# Altium schematic sheet Driver.SchDoc
size A4
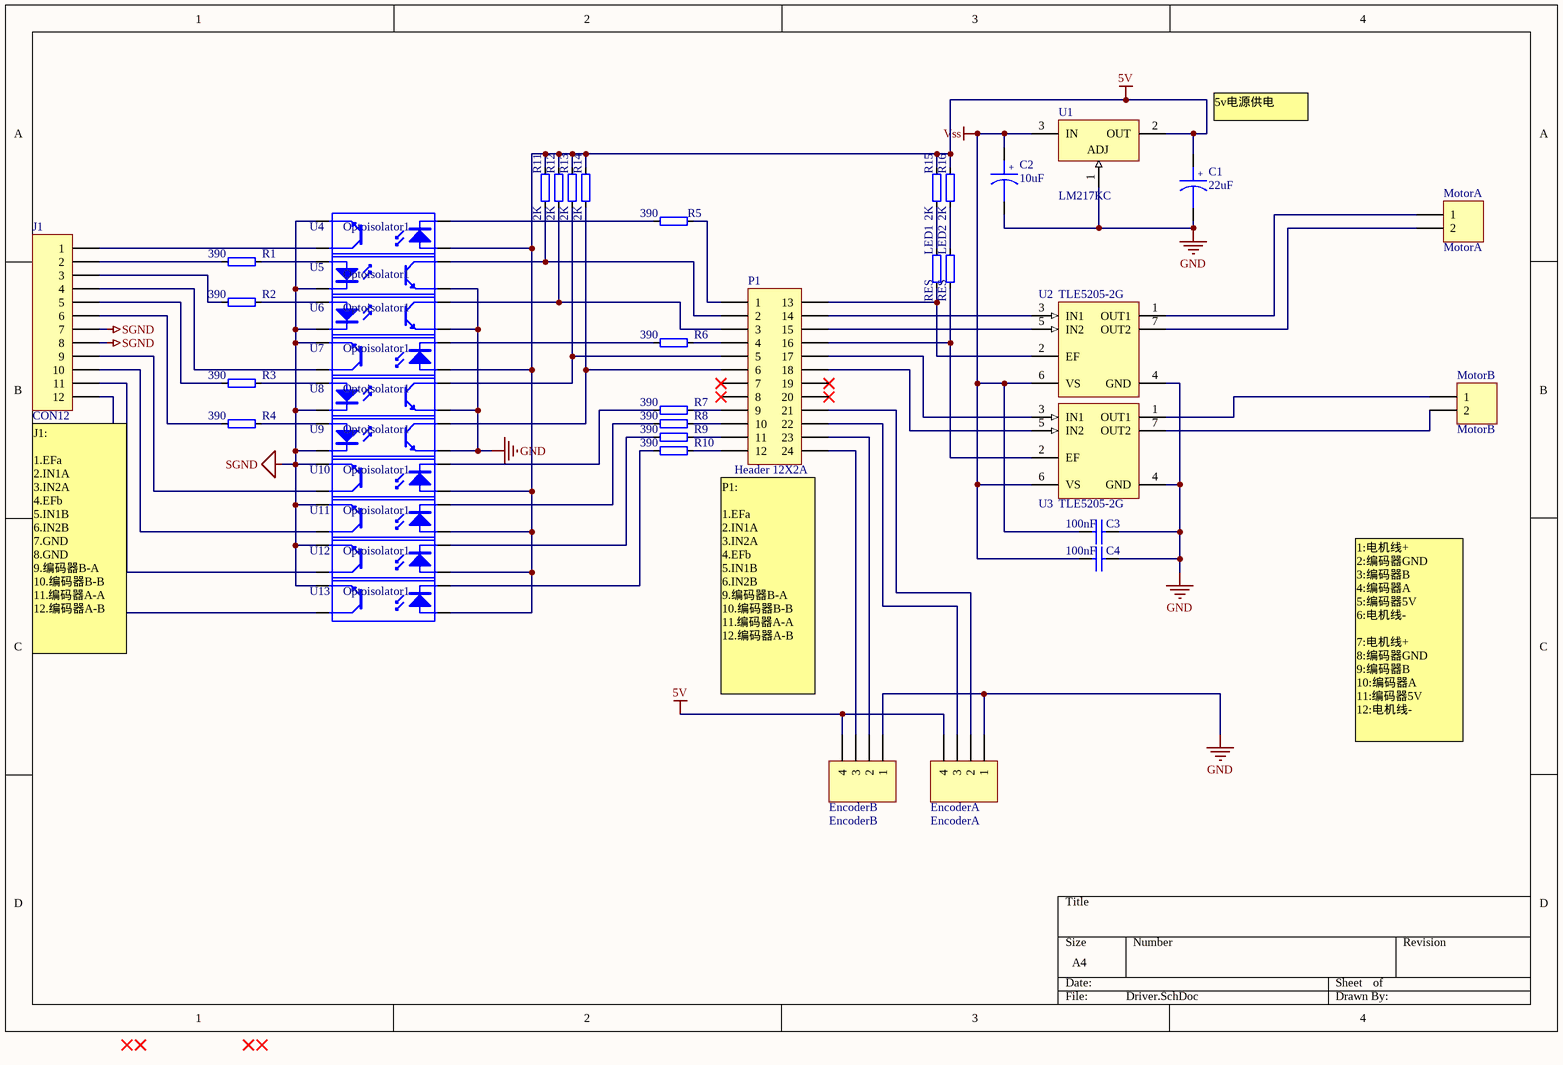
[diagram p0: Driver.SchDoc]

## Parts
C1  22uF  [RB.2/.4]
C2  10uF  [RB.2/.4]
C3  100nF  [0805]
C4  100nF  [0805]
EncoderA  EncoderA  [SIP4-150]
EncoderB  EncoderB  [SIP4-150]
J1  CON12  [si12]
LED1  RES  [LED-0805]
LED2  RES  [LED-0805]
MotorA  MotorA  [SIP2-150]
MotorB  MotorB  [SIP2-150]
P1  Header 12X2A  [si2333]
R1  390  [0603i]
R2  390  [0603i]
R3  390  [0603i]
R4  390  [0603i]
R5  390  [0603i]
R6  390  [0603i]
R7  390  [0603i]
R8  390  [0603i]
R9  390  [0603i]
R10  390  [0603i]
R11  2K  [0603i]
R12  2K  [0603i]
R13  2K  [0603i]
R14  2K  [0603i]
R15  2K  [0603i]
R16  2K  [0603i]
U1  LM217KC  [SOT223]
U2  TLE5205-2G  [INF-PG-TO263-7-1_L]
U3  TLE5205-2G  [INF-PG-TO263-7-1_L]
U4  Optoisolator1  [TLP281]
U5  Optoisolator1  [TLP281]
U6  Optoisolator1  [TLP281]
U7  Optoisolator1  [TLP281]
U8  Optoisolator1  [TLP281]
U9  Optoisolator1  [TLP281]
U10  Optoisolator1  [TLP281]
U11  Optoisolator1  [TLP281]
U12  Optoisolator1  [TLP281]
U13  Optoisolator1  [TLP281]

## Nets
5V: C1.1 EncoderA.4 EncoderB.4 R11.1 R12.1 R13.1 R14.1 R15.1 R16.1 U1.2(OUT) U4.1(A) U7.1(A) U10.1(A) U11.1(A) U12.1(A) U13.1(A)
GND: C1.2 C2.2 C3.2 C4.2 EncoderA.1 EncoderB.1 U1.1(ADJ) U2.4(GND) U3.4(GND) U5.3(E) U6.3(E) U8.3(E) U9.3(E)
SGND: J1.7 J1.8 U4.3(E) U5.2(K) U6.2(K) U7.3(E) U8.2(K) U9.2(K) U10.3(E) U11.3(E) U12.3(E) U13.3(E)
Vss: C2.1 C3.1 C4.1 U1.3(IN) U2.6(VS) U3.6(VS)
NetEncoderA_2: EncoderA.2 P1.21
NetEncoderA_3: EncoderA.3 P1.22
NetEncoderB_2: EncoderB.2 P1.23
NetEncoderB_3: EncoderB.3 P1.24
NetJ1_1: J1.1 U4.4(C)
NetJ1_2: J1.2 R1.2
NetJ1_3: J1.3 R2.2
NetJ1_4: J1.4 U7.4(C)
NetJ1_5: J1.5 R3.2
NetJ1_6: J1.6 R4.2
NetJ1_9: J1.9 U10.4(C)
NetJ1_10: J1.10 U11.4(C)
NetJ1_11: J1.11 U12.4(C)
NetJ1_12: J1.12 U13.4(C)
NetLED1_1: LED1.1 R15.2
NetLED1_2: LED1.2 P1.13 U2.2(EF)
NetLED2_1: LED2.1 R16.2
NetLED2_2: LED2.2 P1.16 U3.2(EF)
NetMotorA_1: MotorA.1 U2.1(OUT1)
NetMotorA_2: MotorA.2 U2.7(OUT2)
NetMotorB_1: MotorB.1 U3.1(OUT1)
NetMotorB_2: MotorB.2 U3.7(OUT2)
NetP1_1: P1.1 R5.1
NetP1_2: P1.2 R11.2 U5.4(C)
NetP1_3: P1.3 R12.2 U6.4(C)
NetP1_4: P1.4 R6.1
NetP1_5: P1.5 R13.2 U8.4(C)
NetP1_6: P1.6 R14.2 U9.4(C)
NetP1_9: P1.9 R7.1
NetP1_10: P1.10 R8.1
NetP1_11: P1.11 R9.1
NetP1_12: P1.12 R10.1
NetP1_14: P1.14 U2.3(IN1)
NetP1_15: P1.15 U2.5(IN2)
NetP1_17: P1.17 U3.3(IN1)
NetP1_18: P1.18 U3.5(IN2)
NetR1_1: R1.1 U5.1(A)
NetR2_1: R2.1 U6.1(A)
NetR3_1: R3.1 U8.1(A)
NetR4_1: R4.1 U9.1(A)
NetR5_2: R5.2 U4.2(K)
NetR6_2: R6.2 U7.2(K)
NetR7_2: R7.2 U10.2(K)
NetR8_2: R8.2 U11.2(K)
NetR9_2: R9.2 U12.2(K)
NetR10_2: R10.2 U13.2(K)

Not connected (* = marked no-connect by the designer): P1 7* 8* 19* 20*

## Notes on the sheet
- 5v电源供电
- (near J1) J1:
  1.EFa
  2.IN1A
  3.IN2A
  4.EFb
  5.IN1B
  6.IN2B
  7.GND
  8.GND
  9.编码器B-A
  10.编码器B-B
  11.编码器A-A
  12.编码器A-B
- P1:
  1.EFa
  2.IN1A
  3.IN2A
  4.EFb
  5.IN1B
  6.IN2B
  9.编码器B-A
  10.编码器B-B
  11.编码器A-A
  12.编码器A-B
- 1:电机线+
  2:编码器GND
  3:编码器B
  4:编码器A
  5:编码器5V
  6:电机线-
  7:电机线+
  8:编码器GND
  9:编码器B
  10:编码器A
  11:编码器5V
  12:电机线-
- (in symbol 电解电容) +

## Library data of the parts
C1 C2 = 电解电容: Capacitor
C3 C4 = 普通电容: Capacitor
EncoderA EncoderB = Header 4: Header, 4-Pin; LatestRevisionDate: 17-Jul-2002; LatestRevisionNote: Re-released for DXP Platform.; Publisher: Altium Limited
J1 = CON12: Connector
MotorA MotorB = Header 2: Header, 2-Pin; LatestRevisionDate: 17-Jul-2002; LatestRevisionNote: Re-released for DXP Platform.; Publisher: Altium Limited
P1 = Header 12X2A: Header, 12-Pin, Dual row; LatestRevisionDate: 17-Jul-2002; LatestRevisionNote: Re-released for DXP Platform.; Publisher: Altium Limited
R1-R16 = RES
U1 = LM217KC: 3-Terminal Adjustable Regulator; Note: Pin 2 is electrically connected to tab; Published: 15-Apr-2002; DatasheetVersion: Feb-1988; PackageVersion: Sep-1995; PackageReference: KC03; Publisher: Altium Limited; PackageDescription: TO, Thru-Hole, Vertical, Heatsink Mounted; 3 In-Line Leads; Pitch 2.54 mm; ComponentLink1Description: Manufacturer Link; ComponentLink1URL: http://www.ti.com/
U2 U3 = TLE5205-2G: 5 A H-Bridge for DC-Motor Applications, 6 to 40 V, 220 mOhm RDS(on), PG-TO263-7-1, Reel, Green; Manufacturer: Infineon; Current Limit (min.): 6 A; Green: TRUE; Operating Range: 6 to 40 V; Quiescent Current (max.): 10 mA; RthJC (max): 3 K/W; DatasheetVersion: Rev. 1.1; PackageVersion: May-07; PackageReference: PG-TO263-7-1; PackageDescription: 7-Pin Plastic (Green) Transistor Single Outline Package, 9.25 x 10 mm Body, 1.27 mm Pitch; Supplier 1: Digi-Key; Supplier Part Number 1: TLE5205-2GINTR-ND; Supplier 2: Digi-Key; Supplier Part Number 2: TLE5205-2GINCT-ND; Supplier 3: Digi-Key; Supplier Part Number 3: TLE5205-2GINDKR-ND; Supplier 4: Mouser; Supplier Part Number 4: 726-TLE52052G; Halogen-free: TRUE; Packing: Reel; RDS (on) (typ./switch): 220 mOhm; Mounting Technology: Surface Mount; PartNumber: TLE5205-2G; ComponentLink1Description: Manufacturer URL; ComponentLink1URL: http://www.infineon.com/; ComponentLink2Description: Datasheet; ComponentLink2URL: http://www.infineon.com/dgdl/TLE5205-2_DS_11%5B1%5D.pdf?folderId=db3a30431b3e89eb011bb632994f065b&fileId=db3a30431f848401011fc747c7a0797f&location=en.Products.Automotive_ICs.Powertrain_ICs.Powertrain_H-Bridges_for_Electronic_Throttle_Control.DATASHEET.TLE5205-2_DS_11[1].pdf; ComponentLink3Description: Package Specification; ComponentLink3URL: http://www.infineon.com/dgdl/TLE5205-2_DS_11%5B1%5D.pdf?folderId=db3a30431b3e89eb011bb632994f065b&fileId=db3a30431f848401011fc747c7a0797f&sId=db3a30433d68e984013d7d43135b5b6a
U4-U13 = Optoisolator1: 4-Pin Phototransistor Optocoupler; Published: 24-Mar-1999; LatestRevisionDate: 04-Mar-2005; LatestRevisionNote: Sch pins 3 & 4 Swapped.; DatasheetDocument: Nov-2003; PackageReference: DIP-4; Publisher: Altium Limited